# Altium schematic sheet ACKSchematic.SchDoc
size A3; SheetNumber: 4; SheetTotal: 4
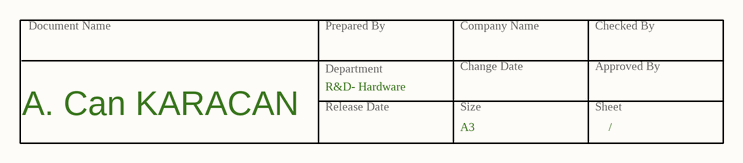
[diagram p0: ACKSchematic.SchDoc]

## Notes on the sheet
- Document Name
- Prepared By
- Company Name
- Checked By
- A. Can KARACAN
- Release Date
- Department
- R&D- Hardware
- Size
- Change Date
- A3
- Approved By
- Sheet
- /